# Altium schematic sheet ElectroMechanical_Control.SchDoc
size A4; Version: V 1.0  Rev A
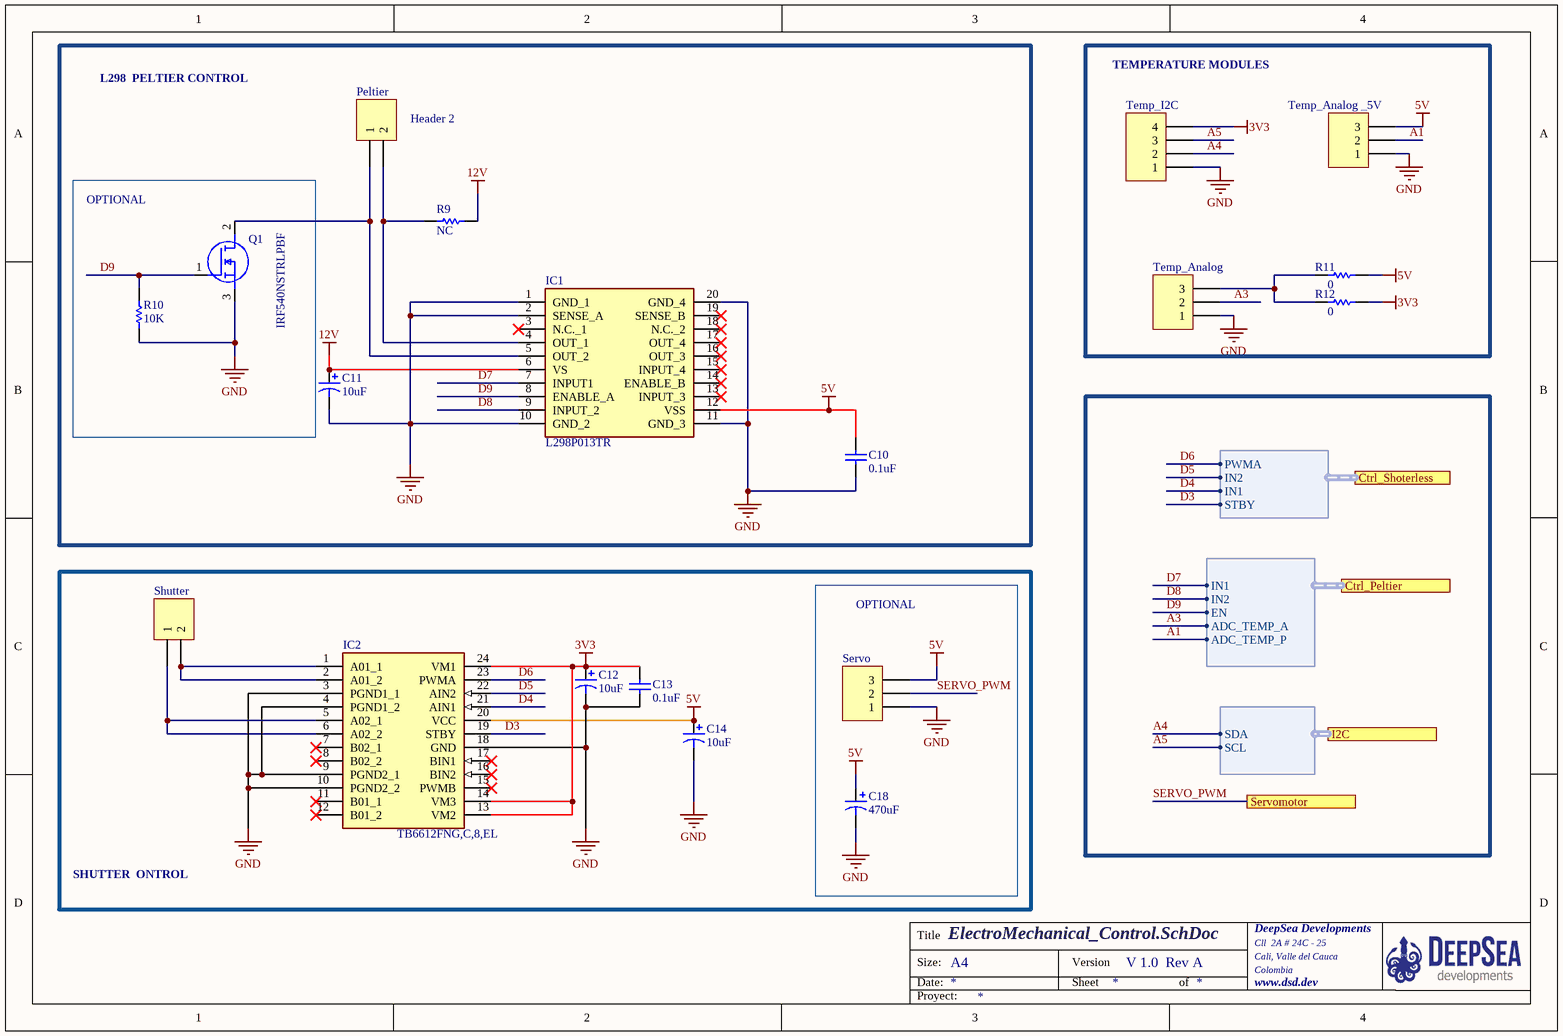
[diagram p0: ElectroMechanical_Control.SchDoc]

## Parts
C10  0.1uF  [C0603_L]
C11  10uF  [C_TANT_A_3216_L]
C12  10uF  [C_TANT_A_3216_L]
C13  0.1uF  [C0603_L]
C14  10uF  [C_TANT_A_3216_L]
C18  470uF  [C_ELECT_8X10_SMD_L]
IC1  L298P013TR  [SOIC127P1420X360-20N]
IC2  TB6612FNG,C,8,EL  [SOP65P760X160-24N]
Peltier  Header 2  [HDR1X2]
Q1  IRF540NSTRLPBF  [D2PAK]
R9  NC  [R0805_M]
R10  10K  [R0603_L]
R11  0  [R0603_L]
R12  0  [R0603_L]
Servo  Temp_Analog  [HDR1X3]  (value not drawn)
Shutter  Shotter  [HDR1X2]  (value not drawn)
Temp_Analog  Temp_Analog  [HDR1X3]  (value not drawn)
Temp_Analog__5V  Temp_Analog _5V  [HDR1X3]  (value not drawn)
Temp_I2C  Temp_I2C  [HDR1X4]  (value not drawn)

## Blocks framed on the sheet
L298  PELTIER CONTROL: C10 C11 IC1 Peltier R9
TEMPERATURE MODULES: R11 R12 Temp_Analog Temp_Analog__5V Temp_I2C
OPTIONAL: Q1 R10
SHUTTER  ONTROL: C12-C14 IC2 Shutter
OPTIONAL: C18 Servo

## Ports
Ctrl_Peltier (harness Ctrl_Peltier), Ctrl_Shoterless (harness Ctrl_Shoterless), I2C (harness I2C), Servomotor

## Harnesses
Ctrl_Peltier: IN1, IN2, EN, ADC_TEMP_A, ADC_TEMP_P
Ctrl_Shoterless: PWMA, IN2, IN1, STBY
I2C: SDA, SCL

## Nets
3V3: C12.1 C13.2 IC2.13(VM2) IC2.14(VM3) IC2.24(VM1) R12.2 Temp_I2C.4
5V: C10.2 C14.1 C18.1 IC1.12(VSS) IC2.20(VCC) R11.2 Servo.3 Temp_Analog__5V.3
12V: C11.1 IC1.6(VS) R9.2
GND: C10.1 C11.2 C12.2 C13.1 C14.2 C18.2 IC1.1(GND_1) IC1.2(SENSE_A) IC1.10(GND_2) IC1.11(GND_3) IC1.20(GND_4) IC2.3(PGND1_1) IC2.4(PGND1_2) IC2.9(PGND2_1) IC2.10(PGND2_2) IC2.18(GND) Q1.3(S) R10.1 Servo.1 Temp_Analog.1 Temp_Analog__5V.1 Temp_I2C.1
A1: Temp_Analog__5V.2 ; port Ctrl_Peltier.ADC_TEMP_P
A3: Temp_Analog.2 ; port Ctrl_Peltier.ADC_TEMP_A
A4: Temp_I2C.2 ; port I2C.SDA
A5: Temp_I2C.3 ; port I2C.SCL
D3: IC2.19(STBY) ; port Ctrl_Shoterless.STBY
D4: IC2.21(AIN1) ; port Ctrl_Shoterless.IN1
D5: IC2.22(AIN2) ; port Ctrl_Shoterless.IN2
D6: IC2.23(PWMA) ; port Ctrl_Shoterless.PWMA
D7: IC1.7(INPUT1) ; port Ctrl_Peltier.IN1
D8: IC1.9(INPUT_2) ; port Ctrl_Peltier.IN2
D9: IC1.8(ENABLE_A) Q1.1(G) R10.2 ; port Ctrl_Peltier.EN
SERVO_PWM: Servo.2 ; port Servomotor
NetIC1_4: IC1.4(OUT_1) Peltier.2 R9.1
NetIC1_5: IC1.5(OUT_2) Peltier.1 Q1.2(D)
NetIC2_1: IC2.1(A01_1) IC2.2(A01_2) Shutter.2
NetIC2_5: IC2.5(A02_1) IC2.6(A02_2) Shutter.1
NetR11_1: R11.1 R12.1 Temp_Analog.3

Not connected (* = marked no-connect by the designer): IC1 3(N.C._1)* 13(INPUT_3)* 14(ENABLE_B)* 15(INPUT_4)* 16(OUT_3)* 17(OUT_4)* 18(N.C._2)* 19(SENSE_B)*; IC2 7(B02_1)* 8(B02_2)* 11(B01_1)* 12(B01_2)* 15(PWMB)* 16(BIN2)* 17(BIN1)*

## Notes on the sheet
- Title
- Size:
- Date:
- A4
- Version
- Sheet
- of
- DeepSea Developments
- Cll  2A # 24C - 25
- Cali, Valle del Cauca
- Colombia
- www.dsd.dev
- Proyect:

## Library data of the parts
C10 C13 = C_SMD: Value: 0.1uF
C11 C12 C14 = CP_SMD: Value: 10uF
C18 = C_SMD_UWT1A471MNL1GS: CAP ALUM 470UF 20% 10V SMD; Manufacturer: Nichicon; Lifetime @ Temp.: 1000 Hrs @ 105°C; Polarization: Polar; Surface Mount Land Size: 0.327" L x 0.327" W (8.30mm x 8.30mm); Supplier 1: Digi-Key; Manufacturer Part Number: UWT1A471MNL1GS; RoHS: RoHS Compliant; Category: Capacitors; Stock 1: 647; Pricing 1: 1=0.51, 10=0.358, 100=0.236 (USD); Packaging: Cut Tape (CT); Part Status: Active; Tolerance: ±20%; ESR (Equivalent Series Resistance): -; Operating Temperature: -55°C ~ 105°C; Ratings: -; Applications: General Purpose; Lead Spacing: -; Size / Dimension: 0.315" Dia (8.00mm); Height - Seated (Max): 0.394" (10.00mm); Mounting Type: Surface Mount; Package / Case: Radial, Can - SMD; ComponentLink1URL: http://nichicon-us.com/english/products/pdfs/e-uwt.pdf; ComponentLink1Description: http://nichicon-us.com/english/products/pdfs/e-uwt.pdf; Supplier Part Number 1: 493-2169-1-ND
IC1 = L298P013TR: Integrated Circuit; Manufacturer_Name: STMicroelectronics; Datasheet Link: http://www.st.com/content/ccc/resource/technical/document/datasheet/82/cc/3f/39/0a/29/4d/f0/CD00000240.pdf/files/CD00000240.pdf/jcr:content/translations/en.CD00000240.pdf; Height: 3.6mm; Manufacturer_Part_Number: L298P013TR; Mouser Part Number: 511-L298P-TR; Mouser Price/Stock: https://www.mouser.co.uk/ProductDetail/STMicroelectronics/L298P013TR?qs=39wMW%2Fm1xHLrH6PUe%2FOPcw%3D%3D; RS Part Number: 8805308P; RS Price/Stock: http://uk.rs-online.com/web/p/products/8805308P
IC2 = TB6612FNG,C,8,EL: Integrated Circuit; Manufacturer_Name: Toshiba; Datasheet Link: http://toshiba.semicon-storage.com/info/docget.jsp?did=10660&prodName=TB6612FNG; Height: 1.6mm; Manufacturer_Part_Number: TB6612FNG,C,8,EL; Mouser Part Number: 757-TB6612FNGC8EL; Mouser Price/Stock: https://www.mouser.co.uk/ProductDetail/Toshiba/TB6612FNGC8EL?qs=rsevcuukUAy2UalRuv4E%2FQ%3D%3D
Peltier Shutter = Header 2: Header, 2-Pin; LatestRevisionDate: 17-Jul-2002; LatestRevisionNote: Re-released for DXP Platform.; Publisher: Altium Limited
Q1 = IRF540NSTRLPBF: MOSFET (N-Channel); Manufacturer_Name: Infineon; Datasheet Link: https://www.infineon.com/dgdl/irf540nspbf.pdf?fileId=5546d462533600a4015355e3a72819a3; Manufacturer_Part_Number: IRF540NSTRLPBF; Arrow Part Number: IRF540NSTRLPBF; Arrow Price/Stock: https://www.arrow.com/en/products/irf540nstrlpbf/infineon-technologies-ag; Mouser Part Number: 942-IRF540NSTRLPBF; Mouser Price/Stock: https://www.mouser.co.uk/ProductDetail/Infineon-Technologies/IRF540NSTRLPBF?qs=9%252BKlkBgLFf3O%252Bc3IfthtMA%3D%3D
R9-R12 = R_SMD
  R9: Value: NC
  R10: Value: 10K
  R11 R12: Value: 0
Servo Temp_Analog Temp_Analog__5V = Header 3: Header, 3-Pin; LatestRevisionDate: 17-Jul-2002; LatestRevisionNote: Re-released for DXP Platform.; Publisher: Altium Limited
Temp_I2C = Header 4: Header, 4-Pin; LatestRevisionDate: 17-Jul-2002; LatestRevisionNote: Re-released for DXP Platform.; Publisher: Altium Limited